# EAGLE schematic frontend_rv2 (EAGLE 7.7.0)
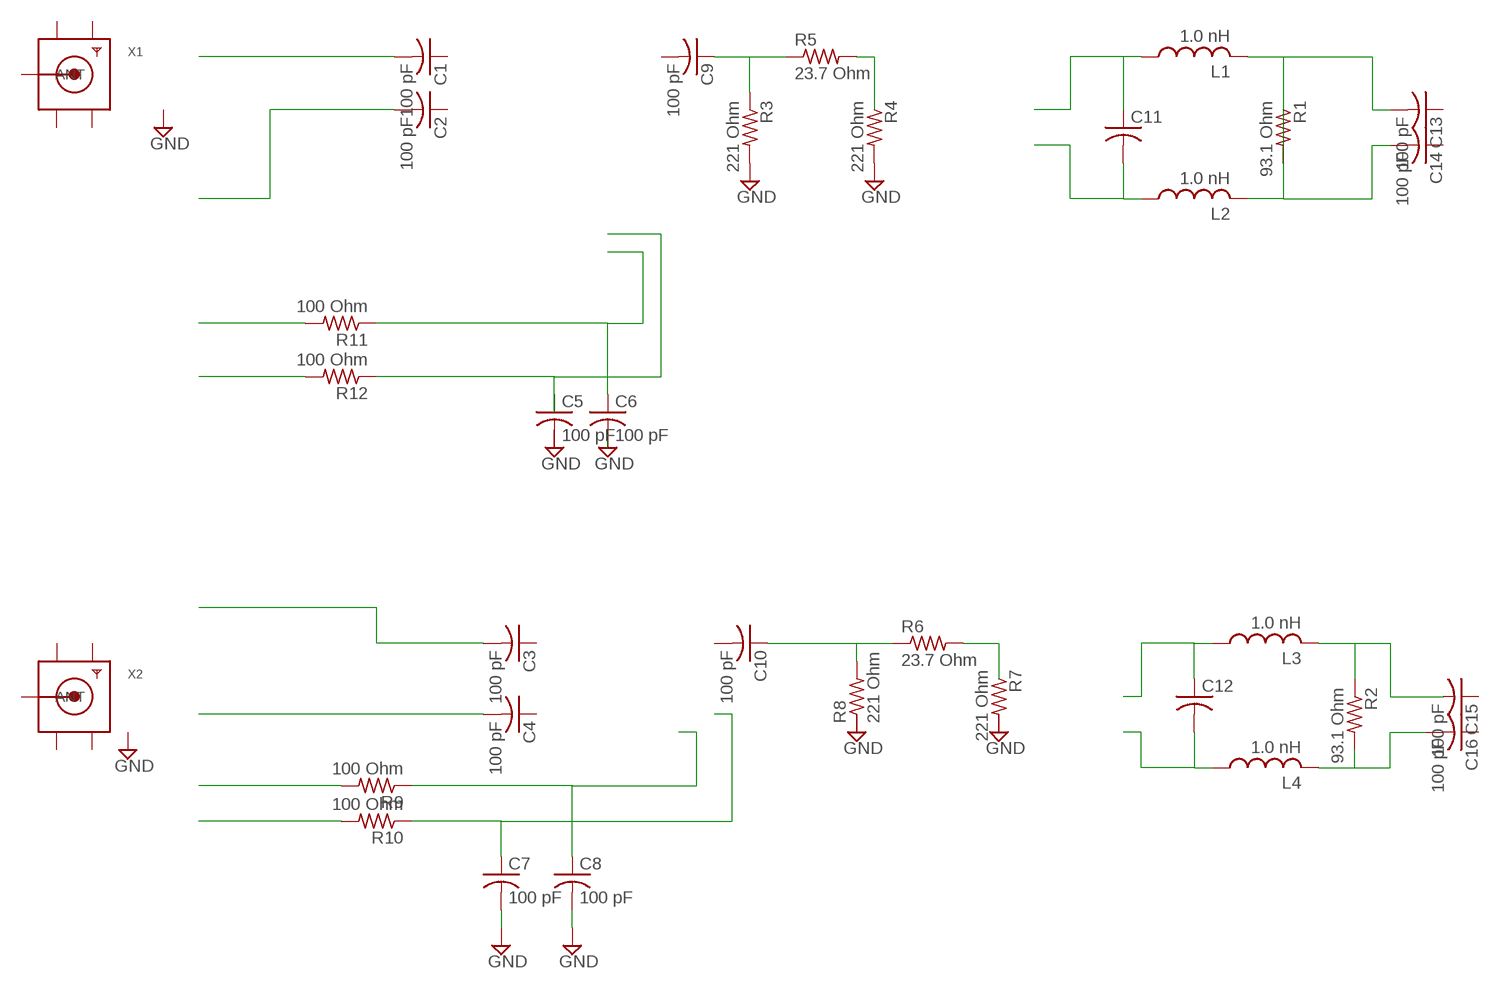
[diagram p0: schematic, sheet 1]

## Parts
C1  100 pF  C-USC0402  [C0402]
C2  100 pF  C-USC0402  [C0402]
C3  100 pF  C-USC0402  [C0402]
C4  100 pF  C-USC0402  [C0402]
C5  100 pF  C-USC0402  [C0402]
C6  100 pF  C-USC0402  [C0402]
C7  100 pF  C-USC0402  [C0402]
C8  100 pF  C-USC0402  [C0402]
C9  100 pF  C-USC0402  [C0402]
C10  100 pF  C-USC0402  [C0402]
C11  C-USC0402  [C0402]
C12  C-USC0402  [C0402]
C13  100 pF  C-USC0402  [C0402]
C14  100 pF  C-USC0402  [C0402]
C15  100 pF  C-USC0402  [C0402]
C16  100 pF  C-USC0402  [C0402]
L1  1.0 nH  L-US0204V  [0204V]
L2  1.0 nH  L-US0204V  [0204V]
L3  1.0 nH  L-US0204V  [0204V]
L4  1.0 nH  L-US0204V  [0204V]
R1  93.1 Ohm  R-US_R0402  [R0402]
R2  93.1 Ohm  R-US_R0402  [R0402]
R3  221 Ohm  R-US_R0402  [R0402]
R4  221 Ohm  R-US_R0402  [R0402]
R5  23.7 Ohm  R-US_R0402  [R0402]
R6  23.7 Ohm  R-US_R0402  [R0402]
R7  221 Ohm  R-US_R0402  [R0402]
R8  221 Ohm  R-US_R0402  [R0402]
R9  100 Ohm  R-US_R0402  [R0402]
R10  100 Ohm  R-US_R0402  [R0402]
R11  100 Ohm  R-US_R0402  [R0402]
R12  100 Ohm  R-US_R0402  [R0402]
X1  SMACONNECTOR_EDGE  [SMA_EDGELAUNCH]
X2  SMACONNECTOR_EDGE  [SMA_EDGELAUNCH]

## Nets
GND: C6.2 C7.2 C8.2 R3.2 R4.2
N$1: C1.2
N$2: C2.2
N$3: C6.1 R11.1
N$4: R12.1
N$5: C3.2
N$6: C4.2
N$7: C8.1 R9.1
N$8: C7.1 R10.1
N$9: C9.1 R3.1 R5.1
N$10: R5.2
N$11: C11.1 L1.1
N$12: C11.2 L2.1
N$13: C10.1 R6.1 R8.2
N$14: R6.2
N$15: C13.2 C14.2 L1.2 L2.2 R1.1 R1.2
N$16: C12.1 L3.1
N$17: C12.2 L4.1
N$18: L3.2 R2.1
N$19: C16.2 L4.2 R2.2
N$20: R11.2
N$21: R12.2
N$22: R9.2
N$23: R10.2
Unconnected: C1.1 C2.1 C3.1 C4.1 C5.1 C5.2 C9.2 C10.2 C13.1 C14.1 C15.1 C15.2 C16.1 R4.1 R7.1 R7.2 R8.1 X1.P(ANT) X2.P(ANT)

## Power pins joined to a net without a drawn wire
GND1: X1.GND@4(GND1) X2.GND@4(GND1)
GND2: X1.GND@3(GND2) X2.GND@3(GND2)
GND3: X1.GND@2(GND3) X2.GND@2(GND3)
GND4: X1.GND@1(GND4) X2.GND@1(GND4)

## Library data of the parts
C1-C16 = resistor:C-US: CAPACITOR, American symbol
L1-L4 = resistor:L-US: INDUCTOR, American symbol
R1-R12 = resistor:R-US_: RESISTOR, American symbol
X1 X2 = adafruit:SMACONNECTOR: SMA Connector 90° DIP SMA Connector, 50 Ohm (4UConnector: 07259)

## Module 132289
Ports: 

### Library data of the parts